# Altium project PCB.PrjPcb
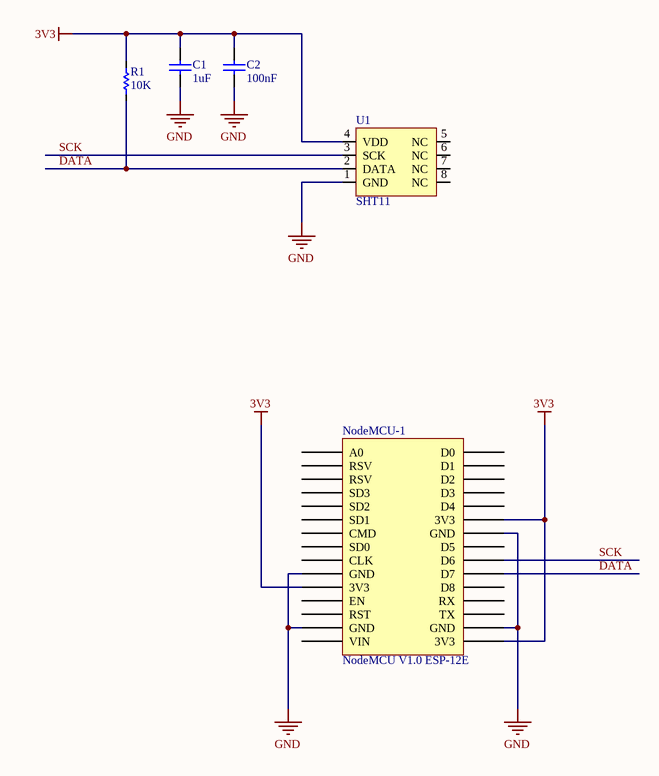
[diagram p0: NodeMCU_Weather.SchDoc]
1 sheet, 5 parts. Net scope: global (net labels, ports and power ports of the same name join across sheets).
Board file: NodeMCU_Weather.PcbDoc

## Sheet NodeMCU_Weather.SchDoc
size A4

### Parts
C1  1uF  [C0402(1005)]
C2  100nF  [C0402(1005)]
NodeMCU-1  NodeMCU V1.0 ESP-12E  [NodeMCU (+ LoLin)]
R1  10K  [R0402(1005)]
U1  SHT11  [SHT11]

### Nets
3V3: C1.2 C2.2 NodeMCU-1.3V3 R1.2 U1.4(VDD)
GND: C1.1 C2.1 NodeMCU-1.GND U1.1(GND)
DATA: NodeMCU-1.D7 R1.1 U1.2(DATA)
SCK: NodeMCU-1.D6 U1.3(SCK)

Not connected (* = marked no-connect by the designer): NodeMCU-1 A0 CLK CMD D0 D1 D2 D3 D4 D5 D8 EN RST RSV RX SD0 SD1 SD2 SD3 TX VIN; U1 5(NC) 6(NC) 7(NC) 8(NC)

### Library data of the parts
C1 C2 = Cap: Capacitor
NodeMCU-1 = NodeMCU V1.0 ESP-12E: NodeMCU V1.0 ESP8266 (ESP-12E)
R1 = R: Resistor
U1 = SHT11: Humidity Temperature Sensor 0 ~ 100% RH Digital ±3% RH 8s Surface Mount